# EAGLE design GWifi (EAGLE 6.5.0)
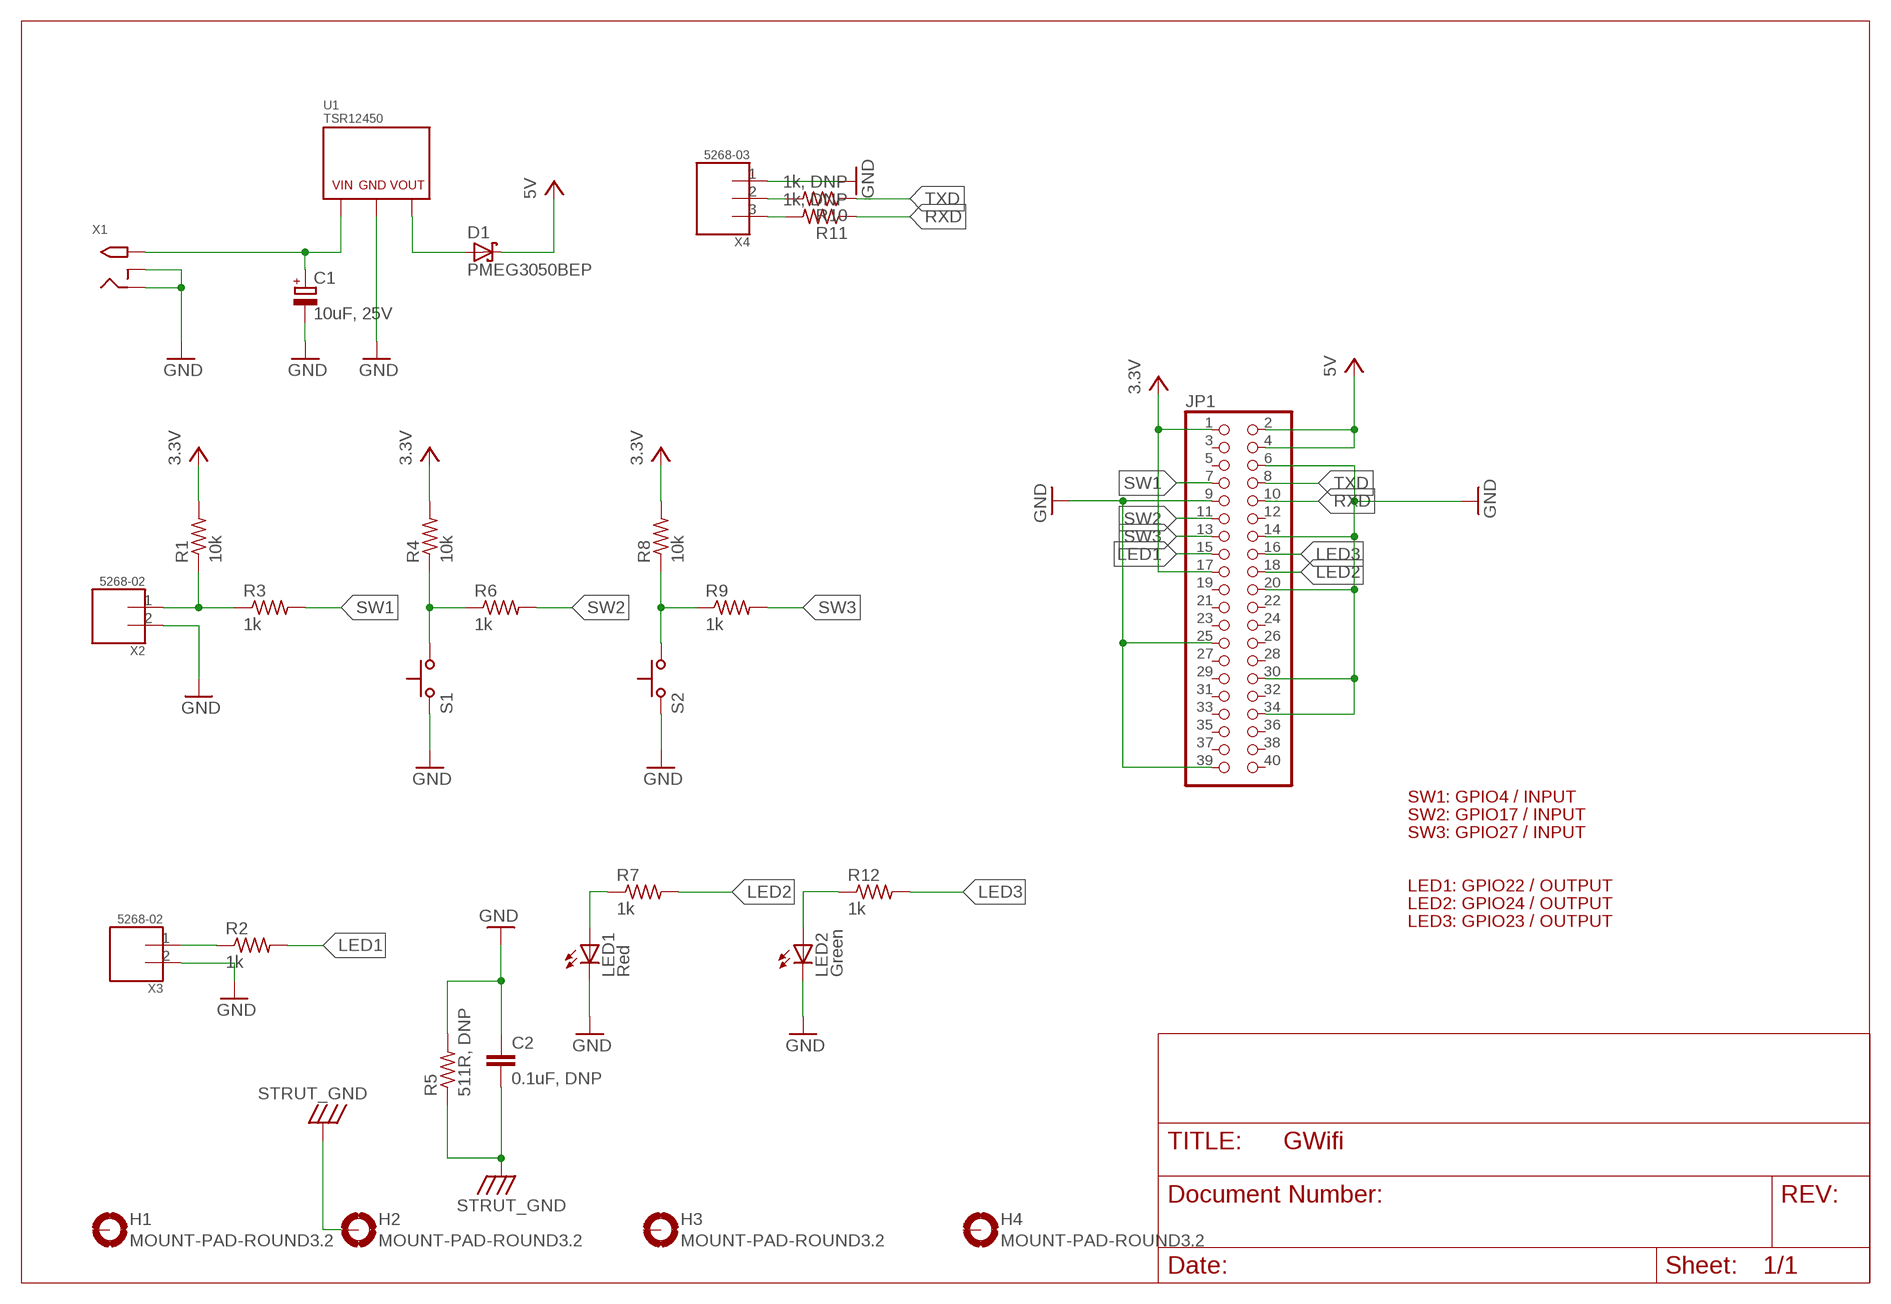
[diagram p0: schematic, sheet 1]

## Parts
C1  10uF, 25V  C-POL-TR3  [C3528-TR3B]
C2  0.1uF, DNP  C0805(2012)  [C0805(2012)]
D1  PMEG3050BEP  PMEG6020EP  [PMEG6020EP]
H1  MOUNT-PAD-ROUND3.2  [3.2-PAD-ROUND]
H2  MOUNT-PAD-ROUND3.2  [3.2-PAD-ROUND]
H3  MOUNT-PAD-ROUND3.2  [3.2-PAD-ROUND]
H4  MOUNT-PAD-ROUND3.2  [3.2-PAD-ROUND]
JP1  PINHD-2X20  [2X20]
LED1  Red  LED3MM  [LED3MM]
LED2  Green  LED3MM  [LED3MM]
R1  10k  R-US_FLIPFLOP  [0805-THM]
R2  1k  R-US_FLIPFLOP  [0805-THM]
R3  1k  R-US_FLIPFLOP  [0805-THM]
R4  10k  R-US_FLIPFLOP  [0805-THM]
R5  511R, DNP  R0805(2012)  [R0805(2012)]
R6  1k  R-US_FLIPFLOP  [0805-THM]
R7  1k  R-US_FLIPFLOP  [0805-THM]
R8  10k  R-US_FLIPFLOP  [0805-THM]
R9  1k  R-US_FLIPFLOP  [0805-THM]
R10  1k, DNP  R0805(2012)  [R0805(2012)]
R11  1k, DNP  R0805(2012)  [R0805(2012)]
R12  1k  R-US_FLIPFLOP  [0805-THM]
S1  SWITCH  [SKHLACA010]
S2  SWITCH  [SKHLACA010]
U1  TSR12450  [TSR12450]
X1  2.1MMJACKTHM  [PJ-102A]
X2  5268-02  [5628-02]
X3  5268-02  [5628-02]
X4  5268-03  [5268-03]

## Nets
3.3V: JP1.1 JP1.17 R1.2 R4.2 R8.2
5V: D1.C JP1.2 JP1.4
GND: C1.- C2.1 JP1.6 JP1.9 JP1.14 JP1.20 JP1.25 JP1.30 JP1.34 JP1.39 LED1.K(C) LED2.K(C) R5.2 S1.P$1 S2.P$1 U1.GND X1.RING X1.RING_SW X2.2 X3.2 X4.1
LED1: JP1.15 R2.2
LED2: JP1.18 R7.2
LED3: JP1.16 R12.2
N$1: C1.+ U1.VIN X1.TIP
N$2: D1.A U1.VOUT
N$3: R1.1 R3.1 X2.1
N$4: R10.2 X4.2
N$5: R11.2 X4.3
N$7: R4.1 R6.1 S1.P$2
N$8: R8.1 R9.1 S2.P$2
N$12: R2.1 X3.1
N$14: LED1.A R7.1
N$15: LED2.A R12.1
RXD: JP1.10 R11.1
STRUT_GND: C2.2 H2.B3,2(MOUNT) R5.1
SW1: JP1.7 R3.2
SW2: JP1.11 R6.2
SW3: JP1.13 R9.2
TXD: JP1.8 R10.1
Unconnected: H1.B3,2(MOUNT) H3.B3,2(MOUNT) H4.B3,2(MOUNT) JP1.3 JP1.5 JP1.12 JP1.19 JP1.21 JP1.22 JP1.23 JP1.24 JP1.26 JP1.27 JP1.28 JP1.29 JP1.31 JP1.32 JP1.33 JP1.35 JP1.36 JP1.37 JP1.38 JP1.40

## Notes on the sheet
- SW1: GPIO4 / INPUT
- SW2: GPIO17 / INPUT
- SW3: GPIO27 / INPUT
- LED1: GPIO22 / OUTPUT
- LED2: GPIO24 / OUTPUT
- LED3: GPIO23 / OUTPUT

## Library data of the parts
C1 = g-project:C-POL
C2 = g-project:C
D1 = OSSI:PMEG6020EP
H1-H4 = OSSI:MOUNT-PAD-ROUND
JP1 = adafruit:PINHD-2X20: PIN HEADER
LED1 LED2 = SparkFun-LED:LED: LEDs Standard schematic elements and footprints for 5mm, 3mm, 1206, and 0603 sized LEDs. 5mm - Spark Fun Electronics SKU : COM-00529 (and others)
R1-R4 R6-R9 R12 = g-project:R-US_: RESISTOR, American symbol
R5 R10 R11 = g-project:R
S1 S2 = WaterDrop:SWITCH
U1 = g-project:TSR12450
X1 = adafruit:2.1MMJACK: 2.1mm x 5.5mm THM DC jack with internal switch. Digikey part #PJ-102A, 4UCON part #05537 2.1mm x 5.5mm SMT DC jack with internal switch. Digikey part #PJ-002A-SMT, 4UCON part #03267 By microbuilder.eu & adafruit.com
X2 X3 = OSSI:5268-02
X4 = OSSI:5268-03

## Board
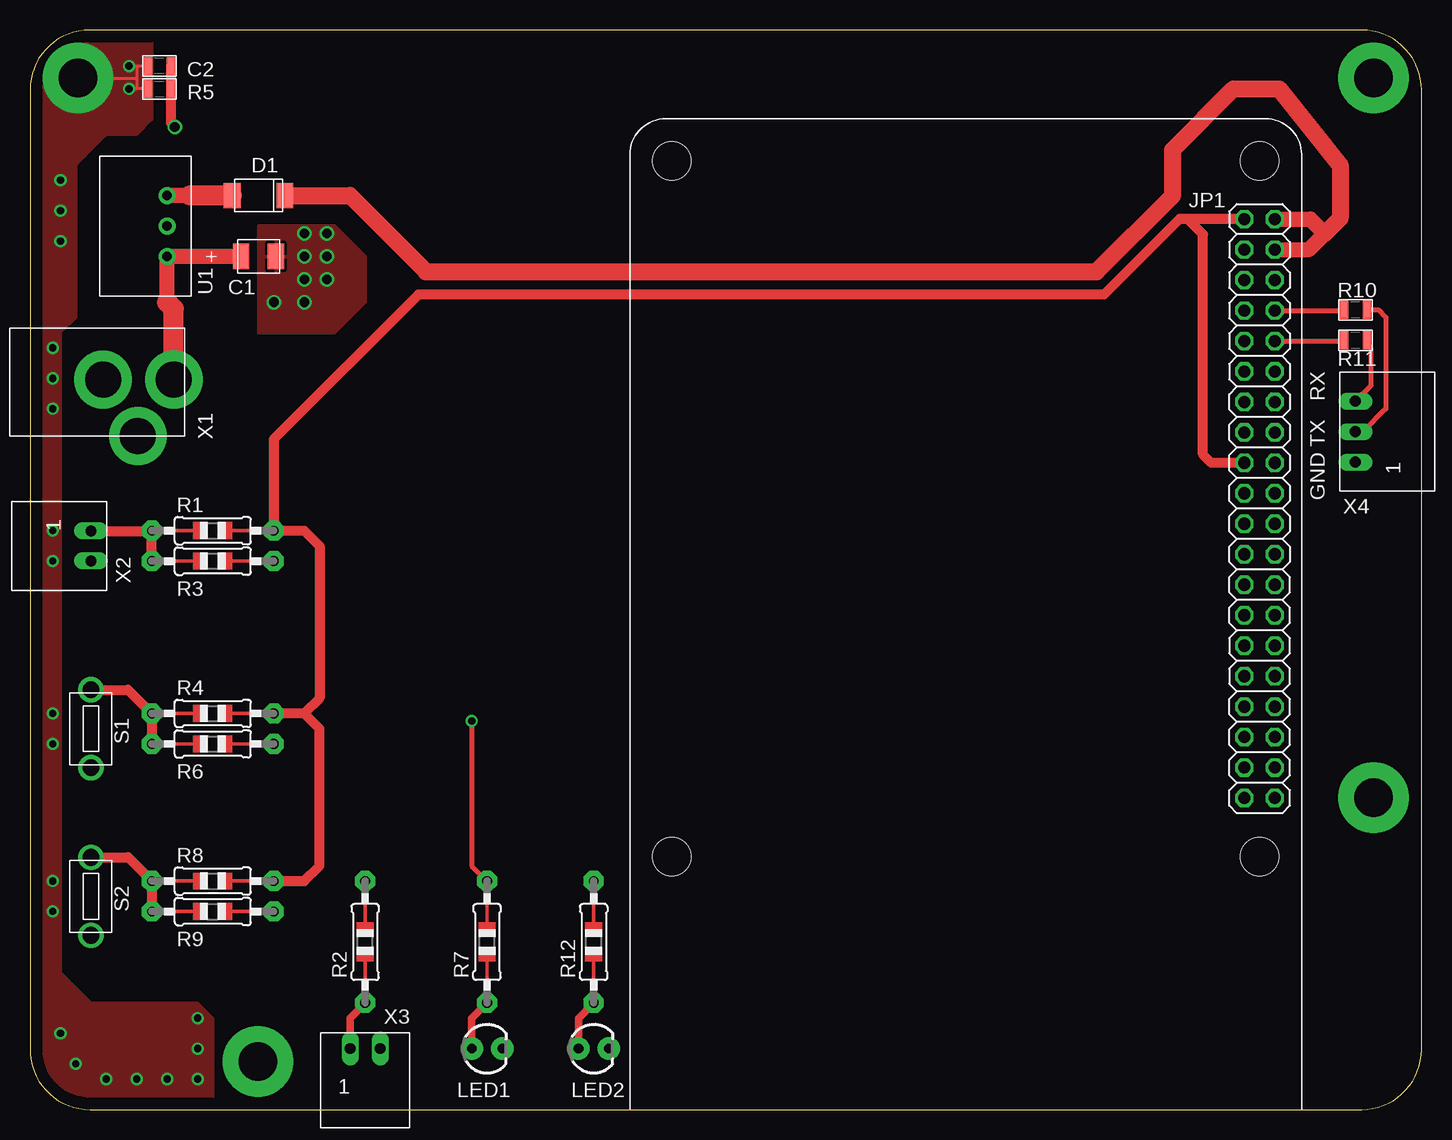
[diagram p1: board, top side]
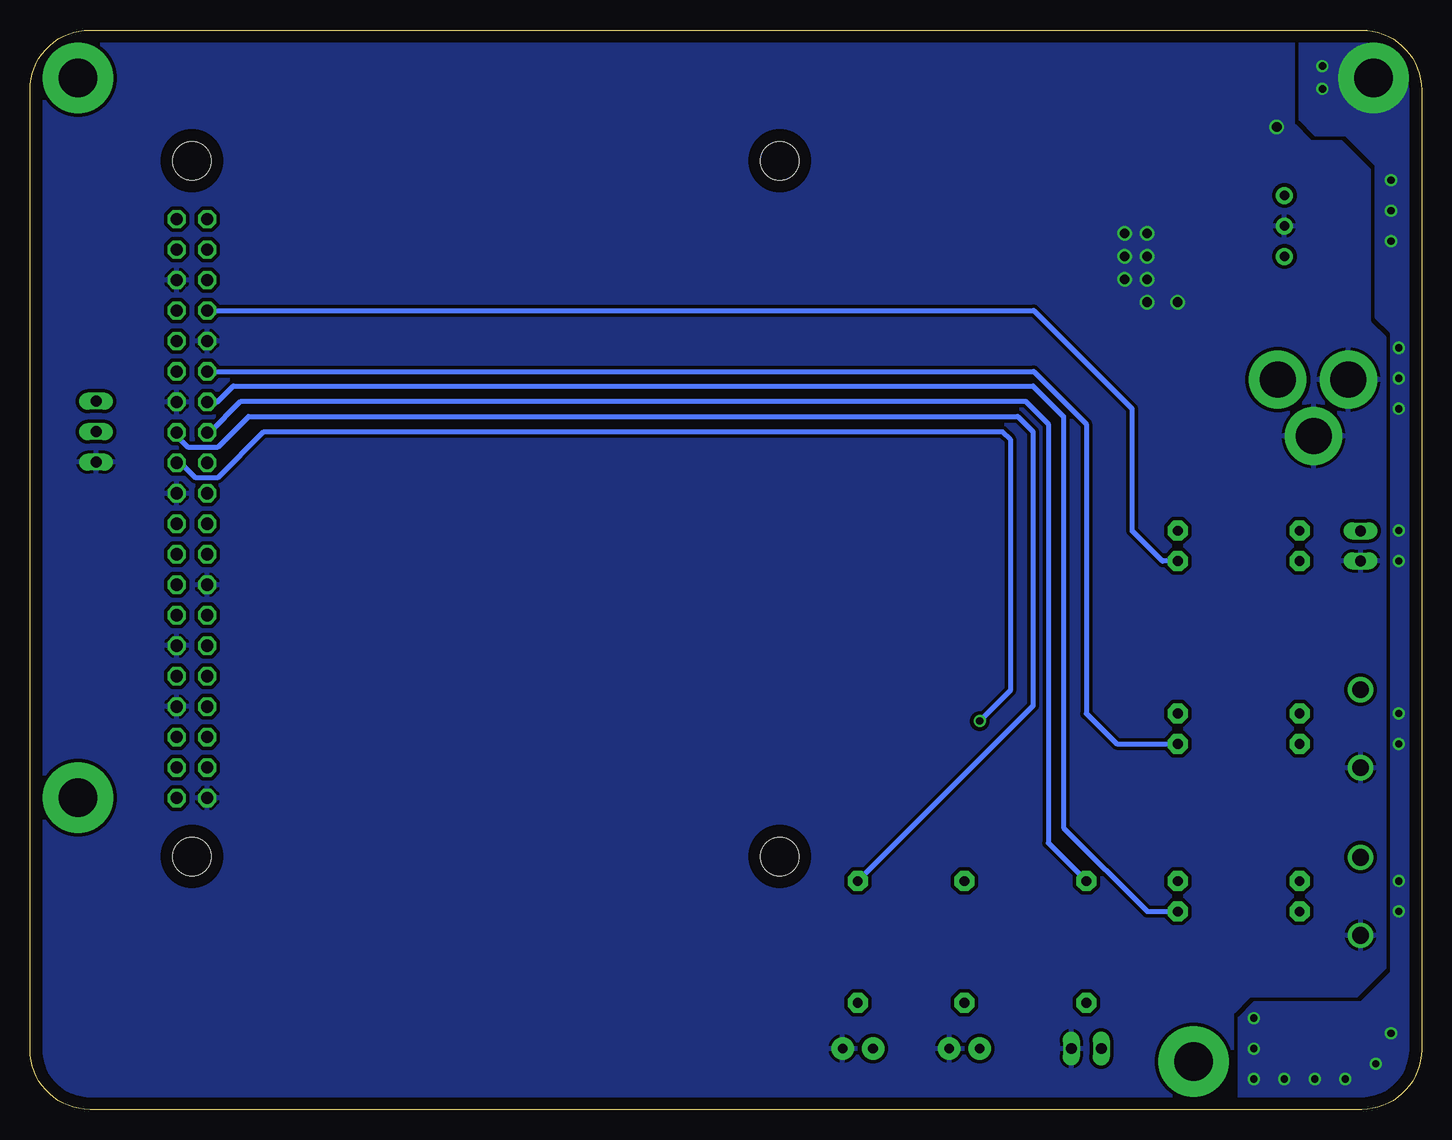
[diagram p2: board, bottom side, seen from below]

Size 116 x 90 mm. Coordinates in mm from the lower left corner, seen from the top.
Outline: 0,85 0,5 arc90 5,0 111,0 arc90 116,5 116,85 arc90 111,90 5,90 arc90 0,85
Copper layers (1*16): Top 0.035mm / dielectric 1.5mm / Bottom 0.035mm
Design rules "default": minimum track width 10mil, minimum drill 24mil, track to track 8mil, track to pad 8mil, pad to pad 8mil, via to via 8mil, smd to smd 8mil, copper to edge 40mil, drill to drill 8mil, minimum pad ring 10mil, minimum via ring 8mil, stop-mask expansion 4mil, vias tented up to drill 0mil, thermal gap 10mil
Holes 3.2 mm at 53.5,79.1 102.5,79.1 53.5,21.1 102.5,21.1

### Footprints (pad centres in the part's own frame; a part is rotated, then mirrored left to right if it is on the bottom)
C3528-TR3B = smd 1.35 x 2.15: + -1.45,0; - 1.45,0
C0805(2012) = smd 0.7 x 1.5: 1 -0.95,0; 2 0.95,0
PMEG6020EP = smd 1.4 x 2.1: A -2.2,0; C 2.2,0
3.2-PAD-ROUND = drill 3.2 pad 5.842: B3,2 0,0
2X20 = drill 1.016 octagon: 1 -24.13,-1.27; 2 -24.13,1.27; 3 -21.59,-1.27; 4 -21.59,1.27; 5 -19.05,-1.27; 6 -19.05,1.27; 7 -16.51,-1.27; 8 -16.51,1.27; 9 -13.97,-1.27; 10 -13.97,1.27; 11 -11.43,-1.27; 12 -11.43,1.27; 13 -8.89,-1.27; 14 -8.89,1.27; 15 -6.35,-1.27; 16 -6.35,1.27; 17 -3.81,-1.27; 18 -3.81,1.27; 19 -1.27,-1.27; 20 -1.27,1.27; 21 1.27,-1.27; 22 1.27,1.27; 23 3.81,-1.27; 24 3.81,1.27; 25 6.35,-1.27; 26 6.35,1.27; 27 8.89,-1.27; 28 8.89,1.27; 29 11.43,-1.27; 30 11.43,1.27; 31 13.97,-1.27; 32 13.97,1.27; 33 16.51,-1.27; 34 16.51,1.27; 35 19.05,-1.27; 36 19.05,1.27; 37 21.59,-1.27; 38 21.59,1.27; 39 24.13,-1.27; 40 24.13,1.27
LED3MM = drill 0.813 pad 1.88: A -1.27,0; K 1.27,0
0805-THM = drill 0.813 pad 1.676 octagon: 1 -5.08,0; 2 5.08,0
R0805(2012) = smd 0.7 x 1.5: 1 -0.95,0; 2 0.95,0
SKHLACA010 = drill 1.4: P$1 -3.25,0; P$2 3.25,0
TSR12450 = drill 0.8 pad 1.422: GND 0,0; VIN -2.54,0; VOUT 2.54,0
PJ-102A = drill 3 pad 4.8: RING 0.1,-3.39; RING_SW -4.6,-6.29; TIP 0.1,-9.29
5628-02 = drill 0.9 long: 1 1.25,0; 2 -1.25,0
5268-03 = drill 0.9 long: 1 2.54,0; 2 0,0; 3 -2.54,0

### Placement (x,y rotation side)
C1  19.05,71.12 0 top
C2  10.79,87 180 top
D1  19.05,76.2 0 top
H1  19,4 0 top
H2  4,86 0 top
H3  112,86 0 top
H4  112,26 0 top
JP1  102.5,50.1 270 top
LED1  38.1,5.08 0 top
LED2  46.99,5.08 0 top
R1  15.24,48.26 0 top
R2  27.94,13.97 90 top
R3  15.24,45.72 0 top
R4  15.24,33.02 0 top
R5  10.79,85.09 0 top
R6  15.24,30.48 0 top
R7  38.1,13.97 90 top
R8  15.24,19.05 0 top
R9  15.24,16.51 0 top
R10  110.49,66.67 0 top
R11  110.49,64.14 0 top
R12  46.99,13.97 90 top
S1  5.08,31.75 90 top
S2  5.08,17.78 90 top
U1  11.43,73.66 90 top
X1  2.7,60.75 90 top
X2  5.08,46.99 90 top
X3  27.94,5.08 180 top
X4  110.49,56.52 270 top

### Tracks (layer width: path | path; a pad name or v marks a point on that pad's centre or on a via)
3.3V
  Top 0.813: JP1.1 96.52,74.23 | 96.52,74.23 95.82,74.23 89.53,67.94 32.38,67.94 20.32,55.88 R1.2 22.86,48.26 24.13,46.99 24.13,34.29 22.86,33.02 | 22.86,33.02 R4.2 | R8.2 22.86,19.05 24.13,20.32 24.13,31.75 22.86,33.02 | JP1.17 98.49,53.91 97.79,54.61 97.79,72.96 96.52,74.23
5V
  Top 1.27: JP1.2 106.75,74.23 107.95,73.03 106.61,71.69 JP1.4
  Top 1.422: D1.C 26.67,76.2 33.02,69.85 88.9,69.85 95.25,76.2 95.25,80.01 100.33,85.09 104.14,85.09 109.22,78.74 109.22,74.3 107.95,73.03
GND  (via drill 0.8)
  Top 0.813: C2.1 R5.2 11.74,82.23 v12.06,81.92
  other vias: 22.86,73.03 22.86,71.12 22.86,69.22 24.77,73.03 24.77,71.12 24.77,69.22 20.32,67.31 22.86,67.31
  pour Bottom (isolate 0.305, rank 2): 0,90.17 116.84,90.17 116.84,0 0,0
  pour Top: 19.05,73.66 19.05,64.77 25.4,64.77 27.94,67.31 27.94,71.12 25.4,73.66
LED1
  Bottom 0.406: JP1.15 101.03,56.45 98.42,59.05 33.02,59.05 31.11,57.15 31.11,22.23 R2.2
LED2  (via drill 0.6)
  Top 0.406: v36.83,32.38 36.83,20.32 R7.2
  Bottom 0.406: JP1.18 103.44,53.91 102.23,52.7 100.33,52.7 96.52,56.52 34.92,56.52 34.29,55.88 34.29,34.92 v36.83,32.38
LED3
  Bottom 0.406: JP1.16 103.77,56.15 102.87,55.24 100.33,55.24 97.79,57.78 33.66,57.78 32.38,56.52 32.38,33.66 R12.2
N$1
  Top 1.27: 11.43,67.31 U1.VIN C1.+
  Top 1.676: X1.TIP 11.99,66.75 11.43,67.31
N$2
  Top 1.27: 13.34,76.2 U1.VOUT
  Top 1.676: D1.A 13.34,76.2
N$3
  Top 0.813: X2.1 10.14,48.24 R1.1 R3.1
N$4
  Top 0.406: R10.2 112.39,66.67 113.03,66.04 113.03,58.42 111.12,56.52 X4.2
N$5
  Top 0.406: R11.2 111.44,63.82 111.76,63.5 111.76,60.33 X4.3
N$7
  Top 0.813: S1.P$2 8.18,35 R4.1 R6.1
N$8
  Top 0.813: S2.P$2 8.18,21.03 R8.1 R9.1
N$12
  Top 0.61: R2.1 26.67,7.62 26.67,5.1 X3.1
N$14
  Top 0.61: R7.1 36.83,7.62 LED1.A
N$15
  Top 0.61: R12.1 45.72,7.62 LED2.A
RXD
  Top 0.406: JP1.10 109.47,64.07 R11.1
STRUT_GND  (via drill 0.6)
  Top 0.254: C2.2 8.89,87 8.89,86 | H2.B3,2 8.89,86 | 8.89,86 8.89,85.09 R5.1
  other vias: 1.91,63.5 1.91,60.96 1.91,58.42 1.91,48.26 1.91,45.72 8.26,87 8.26,85.09 2.54,77.47 2.54,74.93 2.54,72.39 13.97,2.54 13.97,5.08 13.97,7.62 11.43,2.54 8.89,2.54 6.35,2.54 3.81,3.81 2.54,6.35 1.91,16.51 1.91,19.05 1.91,30.48 1.91,33.02
  pour Top (no thermals): 0,90.17 10.16,90.17 10.16,82.55 8.89,81.28 6.35,81.28 3.81,78.74 3.81,66.04 2.54,64.77 2.54,11.43 5.08,8.89 13.97,8.89 15.24,7.62 15.24,0 0,0
  pour Bottom (isolate 0.61, no thermals): 0,90.17 10.16,90.17 10.16,82.55 8.89,81.28 6.35,81.28 3.81,78.74 3.81,66.04 2.54,64.77 2.54,11.43 5.08,8.89 13.97,8.89 15.24,7.62 15.24,0 0,0
SW1
  Bottom 0.406: R3.2 21.59,45.72 24.13,48.26 24.13,58.42 32.32,66.61 JP1.7
SW2
  Bottom 0.406: JP1.11 32.32,61.53 27.94,57.15 27.94,33.02 25.4,30.48 R6.2
SW3
  Bottom 0.406: JP1.13 100.39,58.99 99.06,60.33 32.38,60.33 29.84,57.78 29.84,23.5 22.86,16.51 R9.2
TXD
  Top 0.406: JP1.8 109.47,66.61 R10.1

### Text on the board
tPlace: RX | TX | GND
tNames: X1